# Altium project STM32H743VIT6.PrjPcb
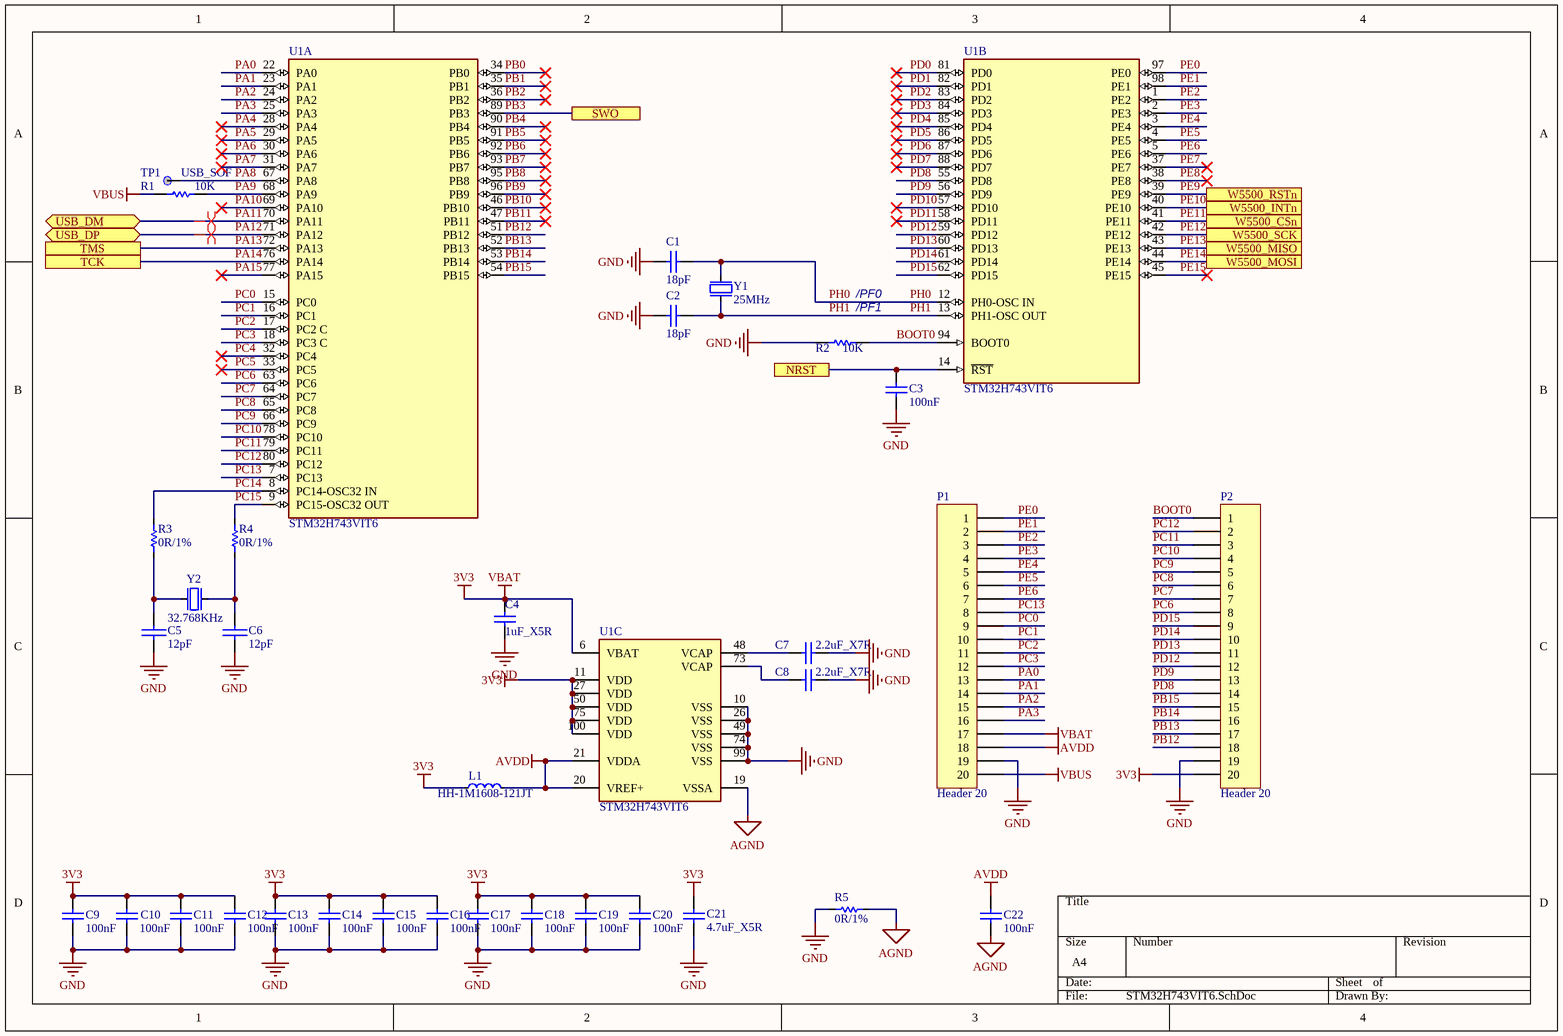
[diagram p0: STM32H743VIT6.SchDoc]
2 sheets, 93 parts. Net scope: flat (ports and power ports of the same name join across sheets).
Board file: STM32H743VIT6.PcbDoc
Sheets:
  STM32H743VIT6.SchDoc
  Connector.SchDoc

## Sheet STM32H743VIT6.SchDoc
size A4; SheetNumber: 1; SheetTotal: 2

### Parts
C1  18pF  [CAP-0402]
C2  18pF  [CAP-0402]
C3  100nF  [CAP-0402]
C4  1uF_X5R  [CAP-0402]
C5  12pF  [CAP-0402]
C6  12pF  [CAP-0402]
C7  2.2uF_X7R  [CAP-0402]
C8  2.2uF_X7R  [CAP-0402]
C9  100nF  [CAP-0402]
C10  100nF  [CAP-0402]
C11  100nF  [CAP-0402]
C12  100nF  [CAP-0402]
C13  100nF  [CAP-0402]
C14  100nF  [CAP-0402]
C15  100nF  [CAP-0402]
C16  100nF  [CAP-0402]
C17  100nF  [CAP-0402]
C18  100nF  [CAP-0402]
C19  100nF  [CAP-0402]
C20  100nF  [CAP-0402]
C21  4.7uF_X5R  [CAP-0402]
C22  100nF  [CAP-0402]
L1  HH-1M1608-121JT  [IND-0603]
P1  Header 20  [IDC-1X20]
P2  Header 20  [IDC-1X20]
R1  10K  [RES-0402]
R2  10K  [RES-0402]
R3  0R/1%  [RES-0402]
R4  0R/1%  [RES-0402]
R5  0R/1%  [RES-0402]
TP1  USB_SOF  [TP]
U1  STM32H743VIT6  [FP-LQFP100-1L-MFG]  (parts A,B,C of 3)
Y1  25MHz  [OSC-S3225A]
Y2  32.768KHz  [OSC-S3225A]

### Ports
NRST, SWO, TCK, TMS, USB_DM (bidir), USB_DP (bidir), W5500_CSn, W5500_INTn, W5500_MISO, W5500_MOSI, W5500_RSTn, W5500_SCK

### Nets
3V3: C4.2 C9.1 C10.1 C11.1 C12.1 C13.1 C14.1 C15.1 C16.1 C17.1 C18.1 C19.1 C20.1 C21.1 L1.1 P1.17 P2.20 U1.6(VBAT) U1.11(VDD) U1.27(VDD) U1.50(VDD) U1.75(VDD) U1.100(VDD)  [also labelled VBAT]
AGND: C22.2 R5.1 U1.19(VSSA)
AVDD: C22.1 L1.2 P1.18 U1.20(VREF+) U1.21(VDDA)
GND: C1.1 C2.1 C3.2 C4.1 C5.2 C6.2 C7.2 C8.2 C9.2 C10.2 C11.2 C12.2 C13.2 C14.2 C15.2 C16.2 C17.2 C18.2 C19.2 C20.2 C21.2 P1.19 P2.19 R2.1 R5.2 U1.10(VSS) U1.26(VSS) U1.49(VSS) U1.74(VSS) U1.99(VSS) Y1.2(GND) Y1.4(GND) Y2.2(GND) Y2.4(GND)
VBUS: P1.20 R1.1
BOOT0: P2.1 R2.2 U1.94(BOOT0)
PA0: P1.13 U1.22(PA0)
PA1: P1.14 U1.23(PA1)
PA2: P1.15 U1.24(PA2)
PA3: P1.16 U1.25(PA3)
PA4: U1.28(PA4)
PA5: U1.29(PA5)
PA6: U1.30(PA6)
PA7: U1.31(PA7)
PA8: TP1.1 U1.67(PA8)
PA9: R1.2 U1.68(PA9)
PA10: U1.69(PA10)
PA11: U1.70(PA11) ; port USB_DM
PA12: U1.71(PA12) ; port USB_DP
PA13: U1.72(PA13) ; port TMS
PA14: U1.76(PA14) ; port TCK
PA15: U1.77(PA15)
PB0: U1.34(PB0)
PB1: U1.35(PB1)
PB2: U1.36(PB2)
PB3: U1.89(PB3) ; port SWO
PB4: U1.90(PB4)
PB5: U1.91(PB5)
PB6: U1.92(PB6)
PB7: U1.93(PB7)
PB8: U1.95(PB8)
PB9: U1.96(PB9)
PB10: U1.46(PB10)
PB11: U1.47(PB11)
PB12: P2.18 U1.51(PB12)
PB13: P2.17 U1.52(PB13)
PB14: P2.16 U1.53(PB14)
PB15: P2.15 U1.54(PB15)
PC0: P1.9 U1.15(PC0)
PC1: P1.10 U1.16(PC1)
PC2: P1.11 U1.17(PC2_C)
PC3: P1.12 U1.18(PC3_C)
PC4: U1.32(PC4)
PC5: U1.33(PC5)
PC6: P2.8 U1.63(PC6)
PC7: P2.7 U1.64(PC7)
PC8: P2.6 U1.65(PC8)
PC9: P2.5 U1.66(PC9)
PC10: P2.4 U1.78(PC10)
PC11: P2.3 U1.79(PC11)
PC12: P2.2 U1.80(PC12)
PC13: P1.8 U1.7(PC13)
PC14: R3.2 U1.8(PC14-OSC32_IN)
PC15: R4.2 U1.9(PC15-OSC32_OUT)
PD0: U1.81(PD0)
PD1: U1.82(PD1)
PD2: U1.83(PD2)
PD3: U1.84(PD3)
PD4: U1.85(PD4)
PD5: U1.86(PD5)
PD6: U1.87(PD6)
PD7: U1.88(PD7)
PD8: P2.14 U1.55(PD8)
PD9: P2.13 U1.56(PD9)
PD10: U1.57(PD10)
PD11: U1.58(PD11)
PD12: P2.12 U1.59(PD12)
PD13: P2.11 U1.60(PD13)
PD14: P2.10 U1.61(PD14)
PD15: P2.9 U1.62(PD15)
PE0: P1.1 U1.97(PE0)
PE1: P1.2 U1.98(PE1)
PE2: P1.3 U1.1(PE2)
PE3: P1.4 U1.2(PE3)
PE4: P1.5 U1.3(PE4)
PE5: P1.6 U1.4(PE5)
PE6: P1.7 U1.5(PE6)
PE7: U1.37(PE7)
PE8: U1.38(PE8)
PE9: U1.39(PE9) ; port W5500_RSTn
PE10: U1.40(PE10) ; port W5500_INTn  [project net INTn]
PE11: U1.41(PE11) ; port W5500_CSn  [project net CSn]
PE12: U1.42(PE12) ; port W5500_SCK
PE13: U1.43(PE13) ; port W5500_MISO  [project net MISO]
PE14: U1.44(PE14) ; port W5500_MOSI  [project net MOSI]
PE15: U1.45(PE15)
PH0: C1.2 U1.12(PH0-OSC_IN) Y1.1(inp)
PH1: C2.2 U1.13(PH1-OSC_OUT) Y1.3(out)
T_NRST: C3.1 U1.14(~{RST}) ; port NRST
NetC5_1: C5.1 R3.1 Y2.1(inp)
NetC6_1: C6.1 R4.1 Y2.3(out)
NetC7_1: C7.1 U1.48(VCAP)
NetC8_1: C8.1 U1.73(VCAP)

### Layout directives
differential pair: PA11, PA12

### Notes on the sheet
- (near R2) /PF0
- (near R2) /PF1

### Library data of the parts
C1 C2 C4 = CAP-0402: Ceramic CAP 0402(1005)
C3 C9-C20 C22 = Cap: 0402; Value: 10nF; Published: 8-Jun-2000; Revision: July-2002: Re-released for DXP Platform.; Publisher: Altium Limited
C5 C6 = CAP: 0402
C7 C8 = Cap_2.2uF_X7R_10%_0805: 0402 X5R; Manuf_Part_1: CC0805KKX7R7BB225; Manuf_1: YAGEO; Value: 2.2uF; Revision: July-2002: Re-released for DXP Platform.; Order: CC0805KKX7R7BB225
C21 = CAP SMD 0603  X5R 1킚 25V 10%: 0402  X5R 4.7uF; Value: 1킚; Rated voltage: 25V; Tolerance: 10%; Manufacturer: *; Manufacturer P/N: *; Order code Farnell: 1288202RL; Power: *; Technology: X5R; Temperature  Factor: *; Temperature Max: +125캜; Temperature Min: -55캜; STS Code: *
L1 = IND-0603: Inductor 0603(1608)
P1 P2 = Header 20: Header, 20-Pin; LatestRevisionDate: 17-Jul-2002; LatestRevisionNote: Re-released for DXP Platform.; Publisher: Altium Limited
R1 = Resistor_ST: 0402; Value: 10K
R2 = res1: Resistor; Value: 1K; Published: 8-Jun-2000; Revision: July-2002: Re-released for DXP Platform.; Publisher: Altium Limited
R3-R5 = RES-0402
TP1 = TP
U1 = CMP-12105-000050-1: IC MCU 32BIT 2MB FLASH 100LQFP; Manufacturer: STMicroelectronics; Number Of Ethernet Channels: 1; Number Of Usb Channels: 2; Number Of A/D Converters: 3; Min Supply Voltage: 1.71V; Ram Size: 1060KBytes; Number Of I2C Channels: 4; Frequency: 480MHz; Number Of Adc Channels: 36; Number Of I/Os: 82; Max Supply Voltage: 3.6V; Number Of Spi Channels: 6; Memory Size: 2MBytes; Max Junction Temp: +125°C; Core Architecture: Arm Cortex-M7; Interface: I2C,SPI,UART,USART,USB,LIN,IrDA,Ethernet,I2S,Other; Number Of Timers/Counters: 20; Data Bus Width: 32bits; Number Of Pwm Channels: 42; Number Of Uart Channels: 9; Standoff Height: 0.05mm; Device Class L1: Integrated Circuits (ICs); ComponentLink2URL: https://www.st.com/resource/en/datasheet/stm32h743vi.pdf; Automotive: No; Memory Type: FLASH; Number Of Cores: 1; Temperature Range Low: -40°C; RoHS: TRUE; Ambient Temperature Range Low: -40°C; ComponentLink2Description: Datasheet; Device Class L2: Embedded Processors and Controllers; Device Class L3: Microcontrollers; Digikey Description: IC MCU 32BIT 2MB FLASH 100LQFP; Temperature Range High: +125°C; Ambient Temperature Range High: +85°C; Package: LQFP100-1L; Temperature: -40°C to +125°C; Category: IC; Ipc Land Pattern Name: QFP50P1600X1600X160-100; Height: 1.6mm; Manufacturer Part Number: STM32H743VIT6; Octopart: https://octopart.com/stm32h743vit6-stmicroelectronics-76372527; Lead Free: Yes
Y1 Y2 = OSC-82J0626-25MHz: X-tal 25MHz,3.2x2.5 SMD, CL=18pF

## Sheet Connector.SchDoc
size A4; SheetNumber: 2; SheetTotal: 2
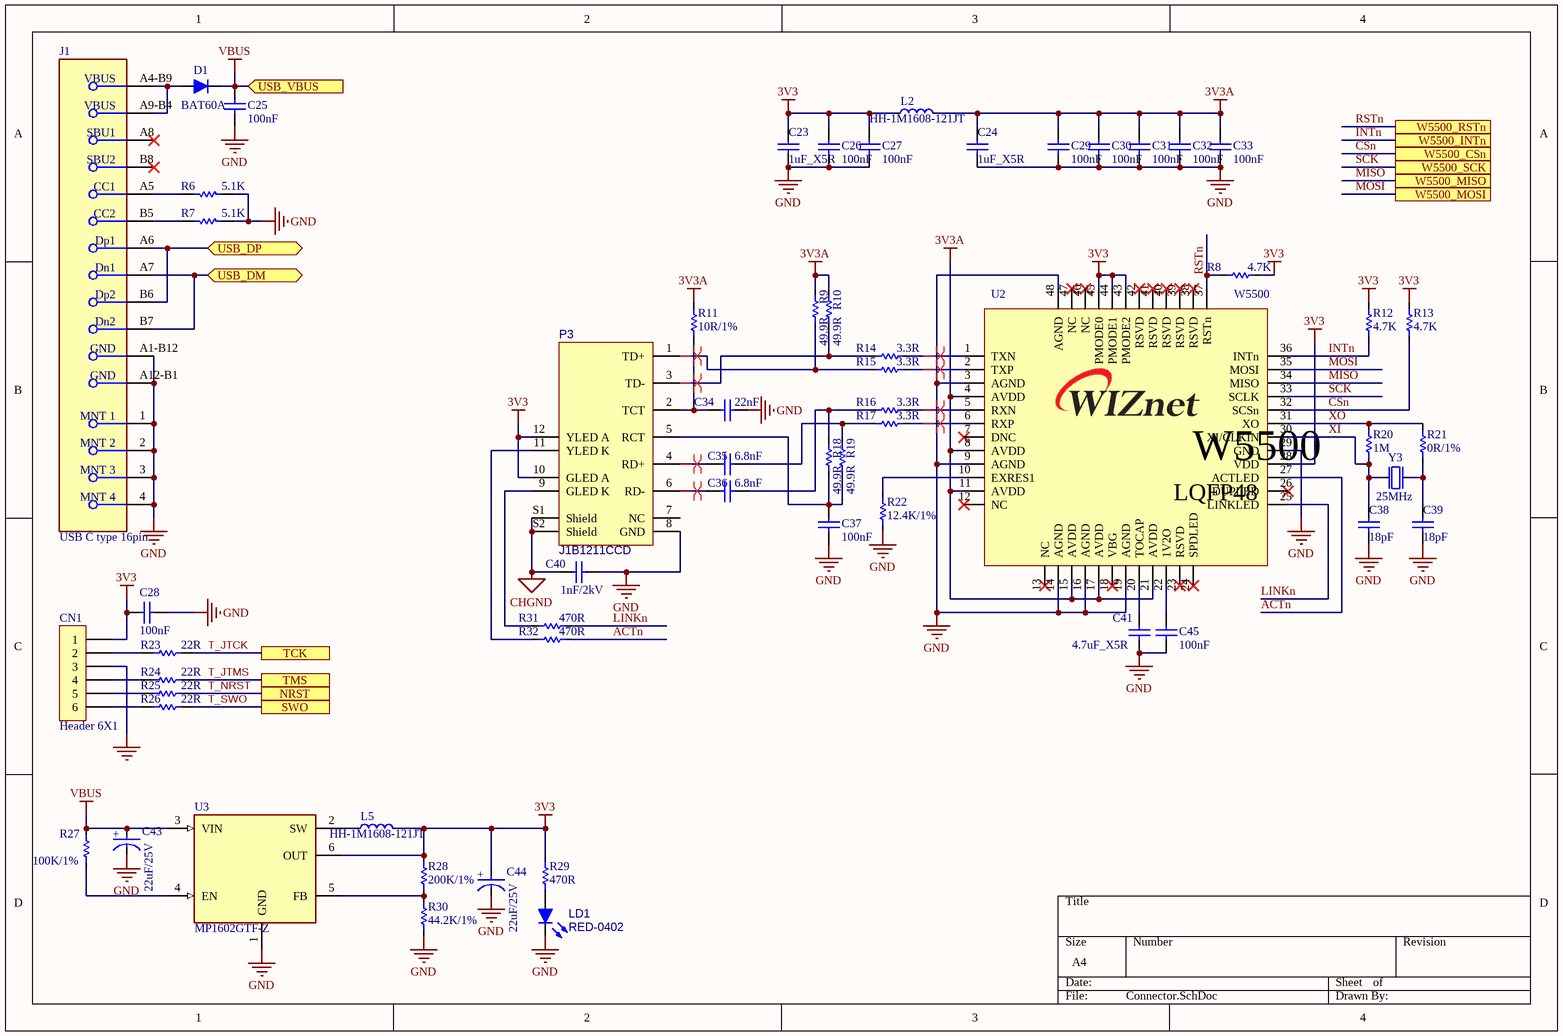
[diagram p1: Connector.SchDoc]

### Parts
C23  1uF_X5R  [CAP-0402]
C24  1uF_X5R  [CAP-0402]
C25  100nF  [0603C]
C26  100nF  [0603C]
C27  100nF  [0603C]
C28  100nF  [0603C]
C29  100nF  [0603C]
C30  100nF  [0603C]
C31  100nF  [0603C]
C32  100nF  [0603C]
C33  100nF  [0603C]
C34  22nF  [CAP-0402]
C35  6.8nF  [CAP-0402]
C36  6.8nF  [CAP-0402]
C37  100nF  [0603C]
C38  18pF  [CAP-0402]
C39  18pF  [CAP-0402]
C40  1nF/2kV  [CAP-1808]
C41  4.7uF_X5R  [0603C]
C43  22uF/25V  [CAP-A Size-(2+)]
C44  22uF/25V  [CAP-A Size-(2+)]
C45  100nF  [0603C]
CN1  Header 6X1  [HDR_1x6_2R54_V_M]
D1  BAT60A  [SOD-323(1-C,2-A)]
J1  USB C type 16pin  [FP-216990-0001-MFG]
L2  HH-1M1608-121JT  [IND-0603]
L5  HH-1M1608-121JT  [IND-0603]
LD1  RED-0402  [LED-0603-RED]
P3  J1B1211CCD  [RJ45-J1B1211CCD]
R6  5.1K  [0603R]
R7  5.1K  [0603R]
R8  4.7K  [RES-0402]
R9  49.9R  [RES-0402]
R10  49.9R  [RES-0402]
R11  10R/1%  [RES-0402]
R12  4.7K  [RES-0402]
R13  4.7K  [RES-0402]
R14  3.3R  [RES-0402]
R15  3.3R  [RES-0402]
R16  3.3R  [RES-0402]
R17  3.3R  [RES-0402]
R18  49.9R  [RES-0402]
R19  49.9R  [RES-0402]
R20  1M  [RES-0402]
R21  0R/1%  [RES-0402]
R22  12.4K/1%  [RES-0402]
R23  22R  [0603R]
R24  22R  [0603R]
R25  22R  [0603R]
R26  22R  [0603R]
R27  100K/1%  [RES-0402]
R28  200K/1%  [RES-0402]
R29  470R  [RES-0402]
R30  44.2K/1%  [RES-0402]
R31  470R  [RES-0402]
R32  470R  [RES-0402]
U2  W5500  [W5500-LQFP48]
U3  MP1602GTF-Z  [SOT-563]
Y3  25MHz  [OSC-82J0626]

### Ports
NRST, SWO, TCK, TMS, USB_DM (bidir), USB_DP (bidir), USB_VBUS (in), W5500_CSn, W5500_INTn, W5500_MISO, W5500_MOSI, W5500_RSTn, W5500_SCK

### Nets
3V3: C23.2 C26.1 C27.1 C28.1 C44.2(A) CN1.1 L2.1 L5.2 P3.10(GLED_A) P3.12(YLED_A) R8.2 R12.1 R13.1 R28.2 R29.2 U2.28(VDD) U2.43(PMODE2) U2.44(PMODE1) U2.45(PMODE0) U3.6(OUT)
3V3A: C24.2 C29.1 C30.1 C31.1 C32.1 C33.1 L2.2 R9.2 R10.2 R11.1 U2.4(AVDD) U2.8(AVDD) U2.11(AVDD) U2.15(AVDD) U2.17(AVDD) U2.21(AVDD)
CHGND: C40.2 P3.S1(Shield) P3.S2(Shield)
GND: C23.1 C24.1 C25.2 C26.2 C27.2 C28.2 C29.2 C30.2 C31.2 C32.2 C33.2 C34.1 C37.2 C38.1 C39.1 C40.1 C41.2 C43.1(C) C44.1(C) C45.2 CN1.3 J1.1(MNT_1) J1.2(MNT_2) J1.3(MNT_3) J1.4(MNT_4) J1.A1-B12(GND) J1.A12-B1(GND) LD1.2(K) P3.8(GND) R6.1 R7.1 R22.2 R30.1 U2.3(AGND) U2.9(AGND) U2.14(AGND) U2.16(AGND) U2.19(AGND) U2.29(GND) U2.48(AGND) U3.1(GND) Y3.2(GND) Y3.4(GND)
VBUS: C25.1 C43.2(A) D1.1(K) R27.1 U3.3(VIN) ; port USB_VBUS
ACTn: R32.2 U2.27(ACTLED)
CSn: R13.2 U2.32(SCSn) ; port W5500_CSn
INTn: R12.2 U2.36(INTn) ; port W5500_INTn
LINKn: R31.2 U2.25(LINKLED)
MISO: U2.34(MISO) ; port W5500_MISO
MOSI: U2.35(MOSI) ; port W5500_MOSI
PA11: J1.A7(Dn1) J1.B7(Dn2) ; port USB_DM
PA12: J1.A6(Dp1) J1.B6(Dp2) ; port USB_DP
RSTn: R8.1 U2.37(RSTn) ; port W5500_RSTn  [project net PE9]
SCK: U2.33(SCLK) ; port W5500_SCK  [project net PE12]
T_JTCK: R23.2 ; port TCK  [project net PA14]
T_JTMS: R24.2 ; port TMS  [project net PA13]
T_NRST: R25.2 ; port NRST
T_SWO: R26.2 ; port SWO  [project net PB3]
XI: C38.2 R20.1 U2.30(XI/CLKIN) Y3.1(inp)
XO: R20.2 R21.2 U2.31(XO)
NetC34_2: C34.2 P3.2(TCT) R11.2
NetC35_1: C35.1 R17.1 R19.2
NetC35_2: C35.2 P3.4(RD+)
NetC36_1: C36.1 R16.1 R18.2
NetC36_2: C36.2 P3.6(RD-)
NetC37_1: C37.1 P3.5(RCT) R18.1 R19.1
NetC39_2: C39.2 R21.1 Y3.3(out)
NetC41_1: C41.1 U2.20(TOCAP)
NetC45_1: C45.1 U2.22(1V2O)
NetCN1_2: CN1.2 R23.1
NetCN1_4: CN1.4 R24.1
NetCN1_5: CN1.5 R25.1
NetCN1_6: CN1.6 R26.1
NetD1_2: D1.2(A) J1.A4-B9(VBUS) J1.A9-B4(VBUS)
NetJ1_A5: J1.A5(CC1) R6.2
NetJ1_B5: J1.B5(CC2) R7.2
NetL5_1: L5.1 U3.2(SW)
NetLD1_1: LD1.1(A) R29.1
NetP3_1: P3.1(TD+) R9.1 R15.1
NetP3_3: P3.3(TD-) R10.1 R14.1
NetP3_9: P3.9(GLED_K) R31.1
NetP3_11: P3.11(YLED_K) R32.1
NetR14_2: R14.2 U2.1(TXN)
NetR15_2: R15.2 U2.2(TXP)
NetR16_2: R16.2 U2.5(RXN)
NetR17_2: R17.2 U2.6(RXP)
NetR22_1: R22.1 U2.10(EXRES1)
NetR27_2: R27.2 U3.4(EN)
NetR28_1: R28.1 R30.2 U3.5(FB)

Not connected (* = marked no-connect by the designer): J1 A8(SBU1)* B8(SBU2)*; P3 7(NC); U2 7(DNC)* 12(NC)* 13(NC)* 18(VBG)* 23(RSVD)* 24(SPDLED)* 26(DUPLED)* 38(RSVD)* 39(RSVD)* 40(RSVD)* 41(RSVD)* 42(RSVD)* 46(NC)* 47(NC)*

### Layout directives
differential pair: NetC35_2, NetC36_2, NetP3_1, NetP3_3, NetR14_2, NetR15_2, NetR16_2, NetR17_2

### Notes on the sheet
- (in symbol CMP-03017-000014-1) +
- (in symbol W5500) LQFP48

### Library data of the parts
C23 C24 C34-C36 C38 C39 = CAP-0402: Ceramic CAP 0402(1005)
C25-C33 C37 C45 = Cap: 0402; Value: 10nF; Published: 8-Jun-2000; Revision: July-2002: Re-released for DXP Platform.; Publisher: Altium Limited
C40 = CAP-1808: Ceramic CAP 1808(4520)
C41 = CAP SMD 0603  X5R 1킚 25V 10%: as C21 on sheet STM32H743VIT6; Manufacturer: *; Manufacturer P/N: *; Order code Farnell: 1288202RL; Power: *; Technology: X5R; Temperature  Factor: *; Temperature Max: +125캜; Temperature Min: -55캜; STS Code: *
C43 C44 = CMP-03017-000014-1: Chip Tantal A size 22uF 25V; Tolerance: 20%; Life (Hours): 2000Hour; Voltage Rating: 6.3V; ESR (Equivalent Series Resistance): 45mR; Capacitance: 100uF; Case Code (Metric): 3216; Features: General Purpose; Max Operating Temperature: 105°C; Case/Package: 1206; Case Code (Imperial): 1206; Min Operating Temperature: -55°C; Mount: Surface Mount; Packaging: Tape and Reel; RoHS Compliant: Yes
CN1 = Header 6X1: Header, 6-Pin, Single row; LatestRevisionDate: 17-Jul-2002; LatestRevisionNote: Re-released for DXP Platform.; Publisher: Altium Limited
D1 = DIODE-BAT60A: Silicon Schottky Diode
J1 = CMP-04767-000014-1
L2 L5 = IND-0603: Inductor 0603(1608)
LD1 = LED-0603: LED-0402
R6 R7 R23-R26 = Resistor_ST: RES-0402; Value: 10K
R8-R22 R27-R32 = RES-0402
U2 = W5500: WIZnet Hardwired TCP/IP Chip
U3 = CMP-04918-000669-1: monolithic, step-down, switchmode converter with built-in internal power MOSFETs. It achieves 2A continuous output current from a 2.5V-to-5.5V input voltage with excellent load and line regulation. The output voltage can be regulated to as low as 0.6V.; RoHS Compliant: Yes
Y3 = OSC-82J0626-25MHz: X-tal 25MHz,3.2x2.5 SMD, CL=18pF

## Nets that join several sheets
3V3: STM32H743VIT6 (23 pins), Connector (20 pins)
GND: STM32H743VIT6 (34 pins), Connector (43 pins)
VBUS: STM32H743VIT6 (P1.20 R1.1), Connector (5 pins)
CSn: STM32H743VIT6 (U1.41), Connector (R13.2 U2.32)
INTn: STM32H743VIT6 (U1.40), Connector (R12.2 U2.36)
MISO: STM32H743VIT6 (U1.43), Connector (U2.34)
MOSI: STM32H743VIT6 (U1.44), Connector (U2.35)
PA11: STM32H743VIT6 (U1.70), Connector (J1.A7 J1.B7)
PA12: STM32H743VIT6 (U1.71), Connector (J1.A6 J1.B6)
PA13: STM32H743VIT6 (U1.72), Connector (R24.2)
PA14: STM32H743VIT6 (U1.76), Connector (R23.2)
PB3: STM32H743VIT6 (U1.89), Connector (R26.2)
PE9: STM32H743VIT6 (U1.39), Connector (R8.1 U2.37)
PE12: STM32H743VIT6 (U1.42), Connector (U2.33)
T_NRST: STM32H743VIT6 (C3.1 U1.14), Connector (R25.2)